# Altium schematic sheet EBAZEXTV1.SchDoc
size A4
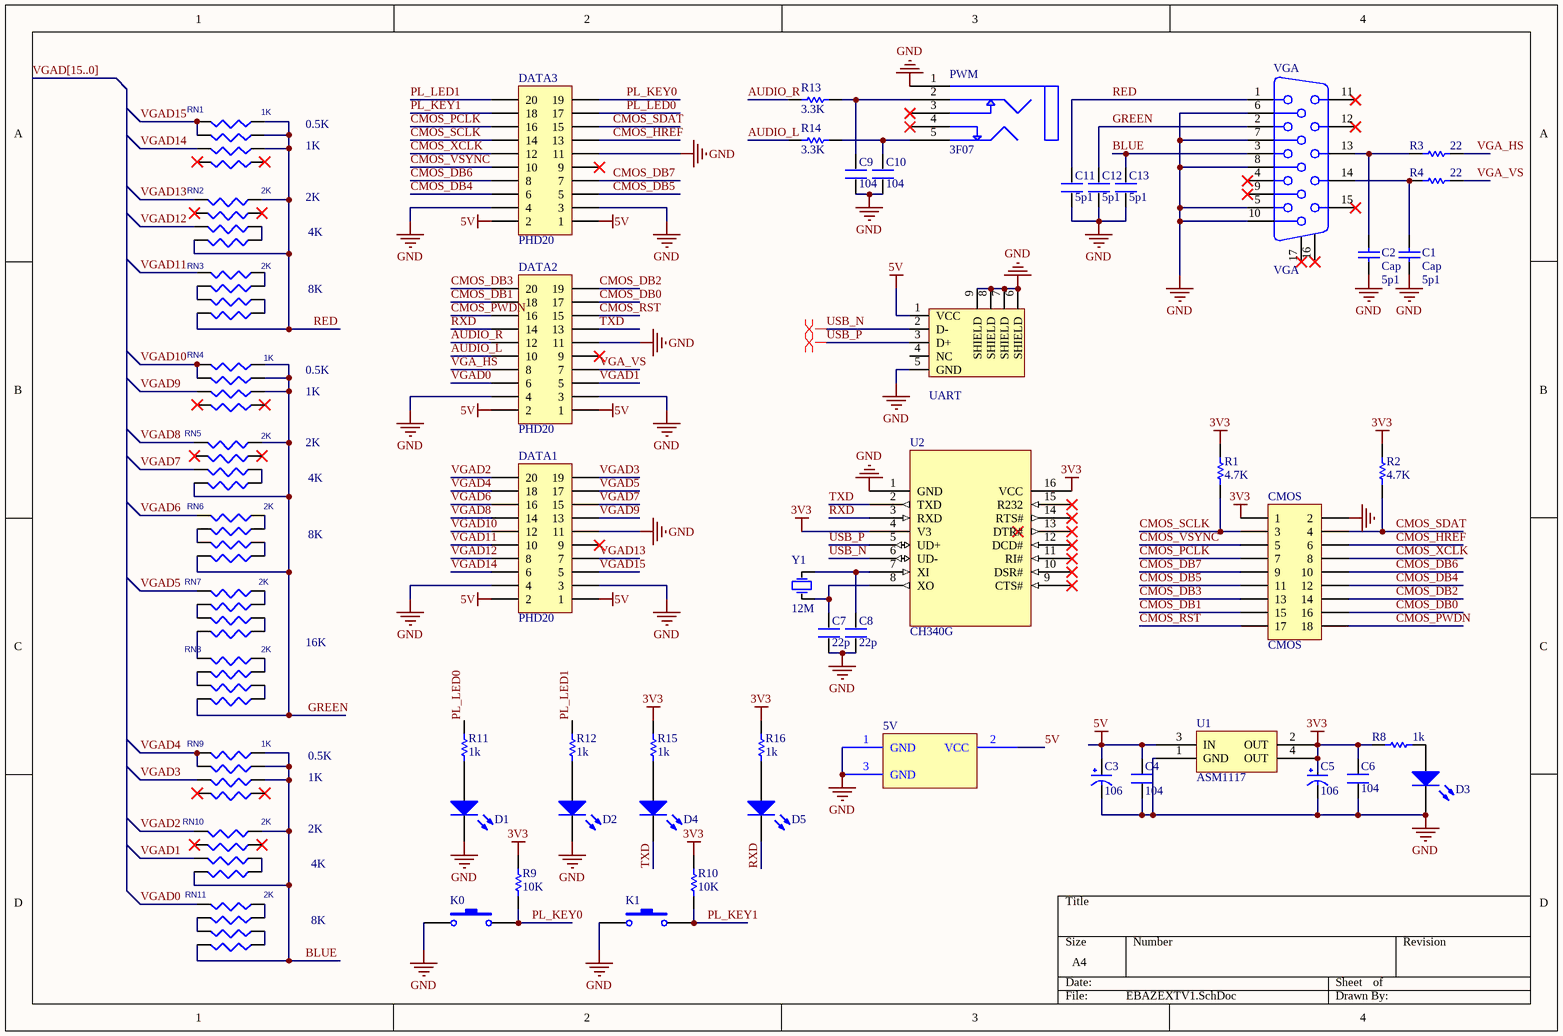
[diagram p0: EBAZEXTV1.SchDoc]

## Parts
5V  DC005电源插座  [POWER_CON_max]  (value not drawn)
C1  Cap  value 5p1  [0805]
C2  Cap  value 5p1  [0805]
C3  106  [1206A]
C4  104  [0805]
C5  106  [1206A]
C6  104  [0805]
C7  22p  [0805]
C8  22p  [0805]
C9  104  [0805]
C10  104  [0805]
C11  5p1  [0805]
C12  5p1  [0805]
C13  5p1  [0805]
CMOS  CMOS  [HDR2X9]
D1  LED0  [LED-0805]  (value not drawn)
D2  LED0  [LED-0805]  (value not drawn)
D3  LED0  [LED-0805]  (value not drawn)
D4  LED0  [LED-0805]  (value not drawn)
D5  LED0  [LED-0805]  (value not drawn)
DATA1  PHD20  [37]
DATA2  PHD20  [37]
DATA3  PHD20  [37]
K0  SW-PB  [key_2]  (value not drawn)
K1  SW-PB  [key_2]  (value not drawn)
PWM  3F07  [3F07]
R1  4.7K  [R0805]
R2  4.7K  [R0805]
R3  22  [R0805]
R4  22  [R0805]
R8  1k  [R0805]
R9  value 10K  [R0805]
R10  value 10K  [R0805]
R11  1k  [R0805]
R12  1k  [R0805]
R13  value 3.3K  [R0805]
R14  value 3.3K  [R0805]
R15  1k  [R0805]
R16  1k  [R0805]
RN1  1K  [RN-8P]
RN2  2K  [RN-8P]
RN3  2K  [RN-8P]
RN4  1K  [RN-8P]
RN5  2K  [RN-8P]
RN6  2K  [RN-8P]
RN7  2K  [RN-8P]
RN8  2K  [RN-8P]
RN9  1K  [RN-8P]
RN10  2K  [RN-8P]
RN11  2K  [RN-8P]
U1  ASM1117  [SOT223]
U2  CH340G  [SOP16]
UART  USB-AB  [USB_AB - 5S - B]  (value not drawn)
VGA  VGA  [DB15-F]
Y1  value 12M  [X-HC-49S]  (hidden comment: XTAL)

## Nets
3V3: C5.1(VCC) C6.2 CMOS.1 R1.1 R2.1 R8.2 R9.2 R10.2 R15.1 R16.1 U1.2(OUT) U1.4(OUT) U2.4(V3) U2.16(VCC)
5V: 5V.2(VCC) C3.1(VCC) C4.2 DATA1.1 DATA1.2 DATA2.1 DATA2.2 DATA3.1 DATA3.2 U1.3(IN) UART.1(VCC)
GND: 5V.1(GND) 5V.3(GND) C1.1 C2.1 C3.2(GND) C4.1 C5.2(GND) C6.1 C7.1 C8.1 C9.1 C10.1 C11.1 C12.1 C13.1 CMOS.2 D1.2(K) D2.2(K) D3.2(K) DATA1.3 DATA1.4 DATA1.11 DATA2.3 DATA2.4 DATA2.11 DATA3.3 DATA3.4 DATA3.11 K0.1 K1.1 PWM.1(COM) U1.1(GND) U2.1(GND) UART.5(GND) UART.6(SHIELD) UART.7(SHIELD) UART.8(SHIELD) UART.9(SHIELD) VGA.5 VGA.6 VGA.7 VGA.8 VGA.10
AUDIO_L: DATA2.10 R14.2
AUDIO_R: DATA2.12 R13.1
BLUE: C13.2 RN9.2 RN9.3 RN9.4 RN10.4 RN10.8 RN11.8 VGA.3
CMOS_DB0: CMOS.16 DATA2.17
CMOS_DB1: CMOS.15 DATA2.18
CMOS_DB2: CMOS.14 DATA2.19
CMOS_DB3: CMOS.13 DATA2.20
CMOS_DB4: CMOS.12 DATA3.6
CMOS_DB5: CMOS.11 DATA3.5
CMOS_DB6: CMOS.10 DATA3.8
CMOS_DB7: CMOS.9 DATA3.7
CMOS_HREF: CMOS.6 DATA3.13
CMOS_PCLK: CMOS.7 DATA3.16
CMOS_PWDN: CMOS.18 DATA2.16
CMOS_RST: CMOS.17 DATA2.15
CMOS_SCLK: CMOS.3 DATA3.14 R1.2
CMOS_SDAT: CMOS.4 DATA3.15 R2.2
CMOS_VSYNC: CMOS.5 DATA3.10
CMOS_XCLK: CMOS.8 DATA3.12
GREEN: C12.2 RN4.2 RN4.3 RN4.4 RN5.4 RN5.8 RN6.8 RN8.8 VGA.2
PL_KEY0: DATA3.19 K0.2 R9.1
PL_KEY1: DATA3.18 K1.2 R10.1
PL_LED0: DATA3.17 R11.1
PL_LED1: DATA3.20 R12.1
RED: C11.2 RN1.2 RN1.3 RN1.4 RN2.4 RN2.8 RN3.8 VGA.1
RXD: D5.2(K) DATA2.14 U2.3(RXD)
TXD: D4.2(K) DATA2.13 U2.2(TXD)
USB_N: U2.6(UD-) UART.2(D-)
USB_P: U2.5(UD+) UART.3(D+)
VGA_HS: DATA2.8 R3.1
VGA_VS: DATA2.7 R4.1
VGAD0: DATA2.6 RN11.5
VGAD1: DATA2.5 RN10.7
VGAD2: DATA1.20 RN10.5
VGAD3: DATA1.19 RN9.7
VGAD4: DATA1.18 RN9.5 RN9.6
VGAD5: DATA1.17 RN7.5
VGAD6: DATA1.16 RN6.5
VGAD7: DATA1.15 RN5.7
VGAD8: DATA1.14 RN5.5
VGAD9: DATA1.13 RN4.7
VGAD10: DATA1.12 RN4.5 RN4.6
VGAD11: DATA1.10 RN3.5
VGAD12: DATA1.8 RN2.7
VGAD13: DATA1.7 RN2.5
VGAD14: DATA1.6 RN1.7
VGAD15: DATA1.5 RN1.5 RN1.6
NetC1_2: C1.2 R4.2 VGA.14
NetC2_2: C2.2 R3.2 VGA.13
NetC7_2: C7.2 U2.8(XO) Y1.1(OSC1)
NetC8_2: C8.2 U2.7(XI) Y1.2(OSC2)
NetC9_2: C9.2 PWM.2(R1) R13.2
NetC10_2: C10.2 PWM.5(L1) R14.1
NetD1_1: D1.1(A) R11.2
NetD2_1: D2.1(A) R12.2
NetD3_1: D3.1(A) R8.1
NetD4_1: D4.1(A) R15.2
NetD5_1: D5.1(A) R16.2
NetRN2_1: RN2.1 RN2.2
NetRN3_1: RN3.1 RN3.2
NetRN3_3: RN3.3 RN3.4
NetRN3_6: RN3.6 RN3.7
NetRN5_1: RN5.1 RN5.2
NetRN6_1: RN6.1 RN6.2
NetRN6_3: RN6.3 RN6.4
NetRN6_6: RN6.6 RN6.7
NetRN7_1: RN7.1 RN7.2
NetRN7_3: RN7.3 RN7.4
NetRN7_6: RN7.6 RN7.7
NetRN7_8: RN7.8 RN8.5
NetRN8_1: RN8.1 RN8.2
NetRN8_3: RN8.3 RN8.4
NetRN8_6: RN8.6 RN8.7
NetRN10_1: RN10.1 RN10.2
NetRN11_1: RN11.1 RN11.2
NetRN11_3: RN11.3 RN11.4
NetRN11_6: RN11.6 RN11.7

Not connected (* = marked no-connect by the designer): DATA1 9*; DATA2 9*; DATA3 9*; PWM 3(R2)* 4(L2)*; RN1 1* 8*; RN2 3* 6*; RN4 1* 8*; RN5 3* 6*; RN9 1* 8*; RN10 3* 6*; U2 9(CTS#)* 10(DSR#)* 11(RI#)* 12(DCD#)* 13(DTR#)* 14(RTS#)* 15(R232)*; UART 4(NC); VGA 4* 9* 11* 12* 15* 16(MH2)* 17(MH1)*

## Buses and harness runs
bus VGAD[15..0]

## Layout directives
differential pair: USB_N, USB_P

## Notes on the sheet
- 0.5K
- 1K
- 2K
- 4K
- 8K
- 16K

## Library data of the parts
5V = POWER_CON
C1 C2 = Cap: Capacitor; Published: 8-Jun-2000; LatestRevisionDate: 17-Jul-2002; LatestRevisionNote: Re-released for DXP Platform.; PackageReference: RAD-0.3; Publisher: Altium Limited; PackageDescription: Radial Cap, Thru-Hole; 2 Leads; 0.3 in Pin Spacing
C3 C5 = CAP
C4 C6-C13 = C_3
CMOS = Header 9X2: Header, 9-Pin, Dual row; LatestRevisionDate: 17-Jul-2002; LatestRevisionNote: Re-released for DXP Platform.; Publisher: Altium Limited
D1-D5 = LED0: 发光二极管; Published: 8-Jun-2000; LatestRevisionDate: 08-Jul-2005; LatestRevisionNote: Mech Layer 1 removed.; PackageReference: LED-0; Publisher: Altium Limited
DATA1-DATA3 = Header 10X2: Header, 10-Pin, Dual row; LatestRevisionDate: 17-Jul-2002; LatestRevisionNote: Re-released for DXP Platform.; Publisher: Altium Limited
K0 K1 = SW-PB: Switch; Published: 24-Mar-1999; LatestRevisionDate: 17-Jul-2002; LatestRevisionNote: Re-released for DXP Platform.; PackageReference: SPST-2; Publisher: Altium Limited; PackageDescription: Switch; 2 Leads
PWM = 3F07: 立体声耳机插座
R1-R4 = RES: Resistor; Value: 1K; Published: 8-Jun-2000; Revision: July-2002: Re-released for DXP Platform.; Publisher: Altium Limited
R8 R11 R12 R15 R16 = RES: Resistor; Published: 8-Jun-2000; Revision: July-2002: Re-released for DXP Platform.; Publisher: Altium Limited; Value: 1K
R9 R10 R13 R14 = Res1: Resistor; Published: 8-Jun-2000; LatestRevisionDate: 17-Jul-2002; LatestRevisionNote: Re-released for DXP Platform.; PackageReference: AXIAL-0.3; Publisher: Altium Limited; PackageDescription: Axial Device, Thru-Hole; 2 Leads; 0.3 in Pin Spacing
RN1-RN11 = RN_Dup1
U1 = ASM1117: 3.3V稳压芯片
U2 = CH340G: USB to TTL Serial / UART
UART = USB-AB: MicroUSB
VGA = D Connector 15: PackageDocument: O; Positions: 9; Gender: Receptacle; Published: 15-Jun-2001; LatestRevisionDate: 17-Jul-2002; LatestRevisionNote: Re-released for DXP Platform.; DatasheetDocument: 1-Sep-1999; PackageReference: 788750; Publisher: Altium Limited; Orientation: Right Angle
Y1 = XTAL: 晶振; Published: 8-Jun-2000; LatestRevisionDate: 17-Jul-2002; LatestRevisionNote: Re-released for DXP Platform.; PackageReference: R38; Publisher: Altium Limited